# EAGLE design barnabas_noggin_V4 (EAGLE 9.6.2)
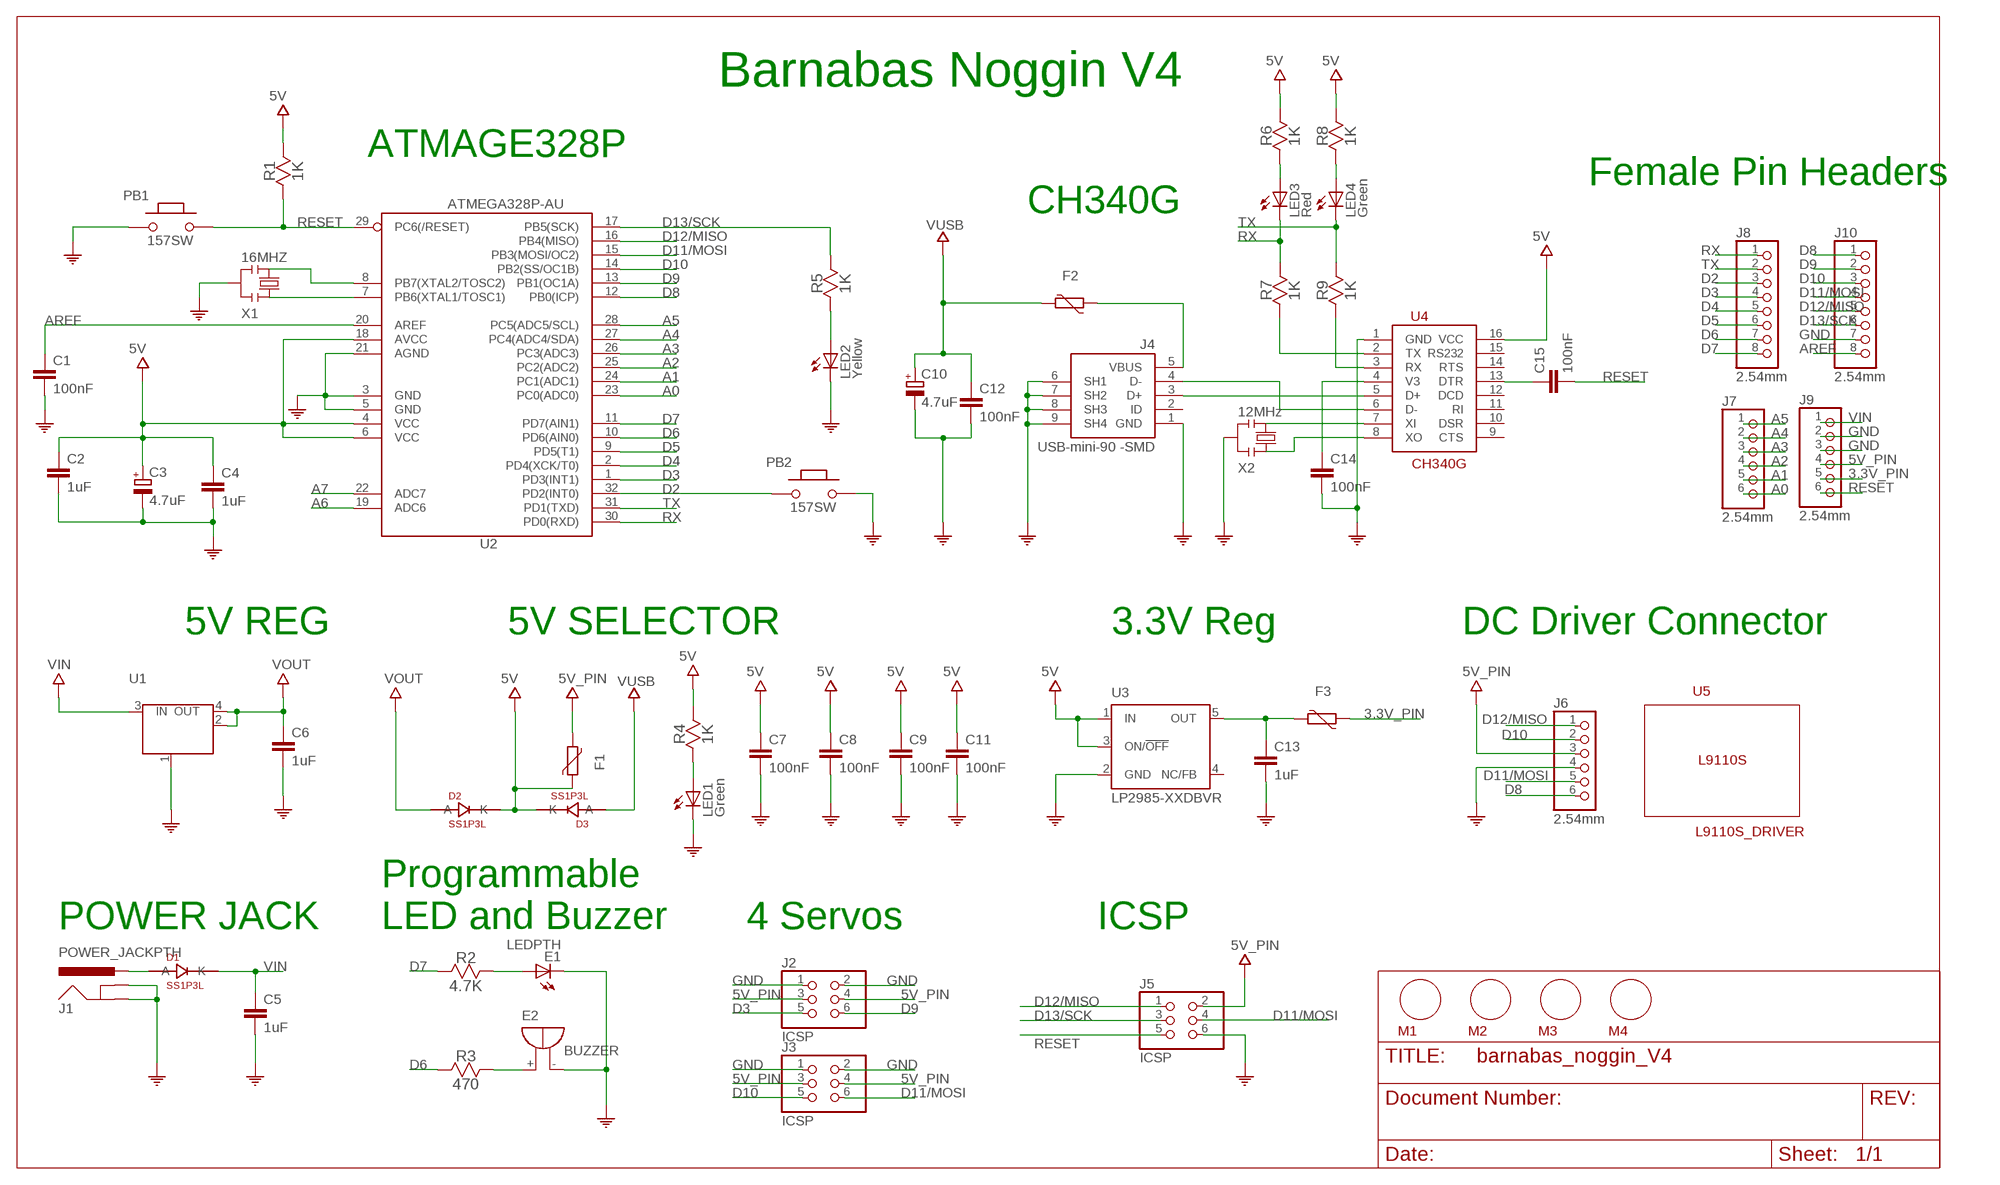
[diagram p0: schematic, sheet 1]

## Parts
C1  100nF  CAPACITOR_100NF_0603  [C0603-ROUND]
C2  1uF  CAPACITOR_1UF_0603  [C0603-ROUND]
C3  4.7uF  CAPACITOR_4.7UF  [TAN-A]
C4  1uF  CAPACITOR_1UF_0603  [C0603-ROUND]
C5  1uF  CAPACITOR_1UF_0603  [C0603-ROUND]
C6  1uF  CAPACITOR_1UF_0603  [C0603-ROUND]
C7  100nF  CAPACITOR_100NF_0603  [C0603-ROUND]
C8  100nF  CAPACITOR_100NF_0603  [C0603-ROUND]
C9  100nF  CAPACITOR_100NF_0603  [C0603-ROUND]
C10  4.7uF  CAPACITOR_4.7UF  [TAN-A]
C11  100nF  CAPACITOR_100NF_0603  [C0603-ROUND]
C12  100nF  CAPACITOR_100NF_0603  [C0603-ROUND]
C13  1uF  CAPACITOR_1UF_0603  [C0603-ROUND]
C14  100nF  CAPACITOR_100NF_0603  [C0603-ROUND]
C15  100nF  CAPACITOR_100NF_0603  [C0603-ROUND]
D1  SS1P3L  SCHOTTKY_DIODE  [DIODI_DO220AAL]
D2  SS1P3L  SCHOTTKY_DIODE  [DIODI_DO220AAL]
D3  SS1P3L  SCHOTTKY_DIODE  [DIODI_DO220AAL]
E1  LEDPTH  [LED5MM]
E2  BUZZER  [BUZZER]
F1  FUSE_6V  [FUSE_0603]
F2  FUSE_6V  [FUSE_0603]
F3  FUSE_6V  [FUSE_0603]
J1  POWER_JACKPTH  [POWER_JACK_PTH]
J2  ICSP  CONNECTOR_2X3  [CONNECTOR_2X3]
J3  ICSP  CONNECTOR_2X3  [CONNECTOR_2X3]
J4  USB-mini-90 -SMD  CONNECTOR_USB_MINI-B  [CONNECTOR_USB_MINI-B]
J5  ICSP  CONNECTOR_2X3  [CONNECTOR_2X3]
J6  2.54mm  PINHD-1X6  [1X06]
J7  2.54mm  PINHD-1X6  [1X06]
J8  2.54mm  PINHD-1X8  [1X08]
J9  2.54mm  PINHD-1X6  [1X06]
J10  2.54mm  PINHD-1X8  [1X08]
LED1  Green  LED_GREEN  [LED_0805]
LED2  Yellow  LED_YELLOW  [LED_0805]
LED3  Red  LED_RED  [LED_0805]
LED4  Green  LED_GREEN  [LED_0805]
M1  MOUNT_HOLE  [MOUNT_HOLE]
M2  MOUNT_HOLE  [MOUNT_HOLE]
M3  MOUNT_HOLE  [MOUNT_HOLE]
M4  MOUNT_HOLE  [MOUNT_HOLE]
PB1  157SW  PUSHBUTTON  [SWITCHES_SMD_157SW]
PB2  157SW  PUSHBUTTON  [SWITCHES_SMD_157SW]
R1  1K  RESISTOR0603  [R0603]
R2  4.7K  RESISTOR  [RESISTOR_PTH]
R3  470  RESISTOR  [RESISTOR_PTH]
R4  1K  RESISTOR0603  [R0603]
R5  1K  RESISTOR0603  [R0603]
R6  1K  RESISTOR0603  [R0603]
R7  1K  RESISTOR0603  [R0603]
R8  1K  RESISTOR0603  [R0603]
R9  1K  RESISTOR0603  [R0603]
U1  LM1117IMPX-5.0  LM1117  [LM1117_SOT223]
U2  ATMEGA328P-AU  ATMEGA328P-32AU  [TQFP32-08]
U3  LP2985-XXDBVR  [SOT23-DBV]
U4  CH340G  [SOIC16]
U5  L9110S_DRIVER  [L9110S_DRIVER]
X1  16MHZ  CRYSTAL_16MHZ  [CRYSTAL]
X2  12MHz  CRYSTAL_12MHZ  [CRYSTAL]

## Nets
3.3V: C13.1 F3.2 U3.5(OUT)
3.3V_PIN: F3.1 J9.5
5V: C2.1 C3.1(+) C4.1 C7.1 C8.1 C9.1 C11.1 D2.P$1(K) D3.P$1(K) F1.1 R1.2 R4.2 R6.2 R8.2 U2.4(VCC) U2.6(VCC) U2.18(AVCC) U3.1(IN) U3.3(ON/!OFF) U4.16(VCC)
5V_PIN: F1.2 J2.3 J2.4 J3.3 J3.4 J5.2 J6.3 J9.4
A0: J7.6 U2.23(PC0(ADC0))
A1: J7.5 U2.24(PC1(ADC1))
A2: J7.4 U2.25(PC2(ADC2))
A3: J7.3 U2.26(PC3(ADC3))
A4: J7.2 U2.27(PC4(ADC4/SDA))
A5: J7.1 U2.28(PC5(ADC5/SCL))
A6: U2.19(ADC6)
A7: U2.22(ADC7)
AREF: C1.1 J10.8 U2.20(AREF)
D2: J8.3 PB2.1 U2.32(PD2(INT0))
D3: J2.5 J8.4 U2.1(PD3(INT1))
D4: J8.5 U2.2(PD4(XCK/T0))
D5: J8.6 U2.9(PD5(T1))
D6: J8.7 R3.1 U2.10(PD6(AIN0))
D7: J8.8 R2.1 U2.11(PD7(AIN1))
D8: J6.6 J10.1 U2.12(PB0(ICP))
D9: J2.6 J10.2 U2.13(PB1(OC1A))
D10: J3.5 J6.2 J10.3 U2.14(PB2(SS/OC1B))
D11/MOSI: J3.6 J5.4 J6.5 J10.4 U2.15(PB3(MOSI/OC2))
D12/MISO: J5.1 J6.1 J10.5 U2.16(PB4(MISO))
D13/SCK: J5.3 J10.6 R5.2 U2.17(PB5(SCK))
GND: C1.2 C2.2 C3.2(-) C4.2 C5.2 C6.2 C7.2 C8.2 C9.2 C10.2(-) C11.2 C12.2 C13.2 C14.2 E1.K(C) E2.- J1.GND J1.GNDBREAK J2.1 J2.2 J3.1 J3.2 J4.1(GND) J4.6(SH1) J4.7(SH2) J4.8(SH3) J4.9(SH4) J5.6 J6.4 J9.2 J9.3 J10.7 LED1.C LED2.C PB1.1 PB2.2 U1.1(GND/ADJ) U2.3(GND) U2.5(GND) U2.21(AGND) U3.2(GND) U4.1(GND) X1.2 X2.2
N$1: U2.8(PB7(XTAL2/TOSC2)) X1.3
N$2: U2.7(PB6(XTAL1/TOSC1)) X1.1
N$3: LED1.A R4.1
N$4: C15.1 U4.13(DTR)
N$5: U4.7(XI) X2.3
N$6: R7.1 U4.2(TX)
N$7: LED3.A R6.1
N$8: R9.1 U4.3(RX)
N$9: LED4.A R8.1
N$10: LED2.A R5.1
N$11: C14.1 U4.4(V3)
N$12: U4.8(XO) X2.1
N$13: J4.3(D+) U4.5(D+)
N$14: J4.4(D-) U4.6(D-)
N$16: D1.P$2(A) J1.PWR
N$17: F2.1 J4.5(VBUS)
N$18: E1.A R2.2
N$19: E2.+ R3.2
RESET: C15.2 J5.5 J9.6 PB1.2 R1.1 U2.29(PC6(/RESET))
RX: J8.1 LED3.C R7.2 U2.30(PD0(RXD))
TX: J8.2 LED4.C R9.2 U2.31(PD1(TXD))
VIN: C5.1 D1.P$1(K) J9.1 U1.3(IN)
VOUT: C6.1 D2.P$2(A) U1.2(OUT) U1.4(OUT)
VUSB: C10.1(+) C12.1 D3.P$2(A) F2.2
Unconnected: J4.2(ID) U3.4(NC/FB) U4.9(CTS) U4.10(DSR) U4.11(RI) U4.12(DCD) U4.14(RTS) U4.15(RS232)

## Notes on the sheet
- Barnabas Noggin V4
- ATMAGE328P
- Female Pin Headers
- CH340G
- 5V REG | 5V SELECTOR | 3.3V Reg | DC Driver Connector
- POWER JACK
- Programmable 
  LED and Buzzer
- 4 Servos | ICSP

## Library data of the parts
C1 C7-C9 C11 C12 C14 C15 = barnabas_noggin_V4:CAPACITOR_100NF_0603: CAP CER 0.1UF 50V Y5V 0603; PARTNO: CC0603ZRY5V9BB104
C2 C4-C6 C13 = barnabas_noggin_V4:CAPACITOR_1UF_0603: 1uF 0603; PARTNO: CC0603KRX5R8BB105
C3 C10 = barnabas_noggin_V4:CAPACITOR_4.7UF: CAP CER 4.7UF 16V X5R 1206; PARTNO: CL31A475KOHNNNE
D1-D3 = barnabas_noggin_V4:SCHOTTKY_DIODE: 1A 30V Schottky Barrier Rectifiers -SS1P3L-M3/84A; PARTNO: SS1P3L-M3/84A
E1 = barnabas_noggin_V4:LEDPTH
E2 = barnabas_noggin_V4:BUZZER: BUZZER Source: Buerklin; OC_FARNELL: unknown; OC_NEWARK: unknown
F1-F3 = barnabas_noggin_V4:FUSE_6V: SMD PTC; PARTNO: MF-FSMF050X-2
J1 = barnabas_noggin_V4:POWER_JACK: Power Jack This is the standard 5.5mm barrel jack for power. The PTH is the most common, proven, reliable, footprint. All others are experimental. The Slot footprint only works if the mill layer is transmitted to the PCB fab house so be warned. Spark Fun Electronics SKU : PRT-00119. Mating wall wart : TOL-00298 (and others); PARTNO: EJ508A
J2 J3 J5 = barnabas_noggin_V4:CONNECTOR_2X3: 3x2 M V h 8,5 mm p2,54; PARTNO: M20-9980346
J4 = barnabas_noggin_V4:CONNECTOR_USB_MINI-B: Usb-Mini F 90 Smd; PARTNO: UJ2-MBH-1-SMT-TR
J6 J7 J9 = barnabas_noggin_V4:PINHD-1X6: PIN HEADER; PARTNO: M20-7820646
J8 J10 = barnabas_noggin_V4:PINHD-1X8: PIN HEADER; PARTNO: PPTC081LFBN-RC
LED1 LED4 = barnabas_noggin_V4:LED_GREEN: LED GREEN - SMD-0805; PARTNO: LTST-C171GKT
LED2 = barnabas_noggin_V4:LED_YELLOW: LED YELLOW - SMD - 0805; PARTNO: LTST-C171KSKT
LED3 = barnabas_noggin_V4:LED_RED: LED RED - SMD - 0805; PARTNO: LTST-C170KRKT
M1-M4 = barnabas_noggin_V4:MOUNT_HOLE
PB1 PB2 = barnabas_noggin_V4:PUSHBUTTON: Pushbutton 4x3 SMD H2,5mm; PARTNO: PTS820 J15M SMTR LFS
R1 R4-R9 = barnabas_noggin_V4:RESISTOR; PARTNO: RC0603FR-071KL
R2 R3 = barnabas_noggin_V4:RESISTOR
U1 = barnabas_noggin_V4:LM1117: Low-dropout linear regulator 5V -LM1117IMPX-5.0; PARTNO: LM1117IMPX-5.0/NOPB
U2 = barnabas_noggin_V4:ATMEGA328P-32: 8-bit Microcontroller with 32KBytes In-System Programmable Flash ATMEGA328P-AU; PARTNO: ATMEGA328P-AU
U3 = barnabas_noggin_V4:LP2985-XXDBVR: ULTRALOW-POWER 50-mA LOW-DROPOUT LINEAR REGULATORS 50-mA Low-Dropout Regulator Source: http://focus.ti.com/lit/ds/symlink/tps77001.pdf; PARTNO: LP2985-33DBVR
U4 = barnabas_noggin_V4:CH340G
U5 = barnabas_noggin_V4:L9110S_DRIVER
X1 = barnabas_noggin_V4:CRYSTAL_16MHZ: 16Mhz - SMD; PARTNO: CSTNE16M0V530000R0
X2 = barnabas_noggin_V4:CRYSTAL_12MHZ; PARTNO: CSTNE12M0G550000R0

## Board
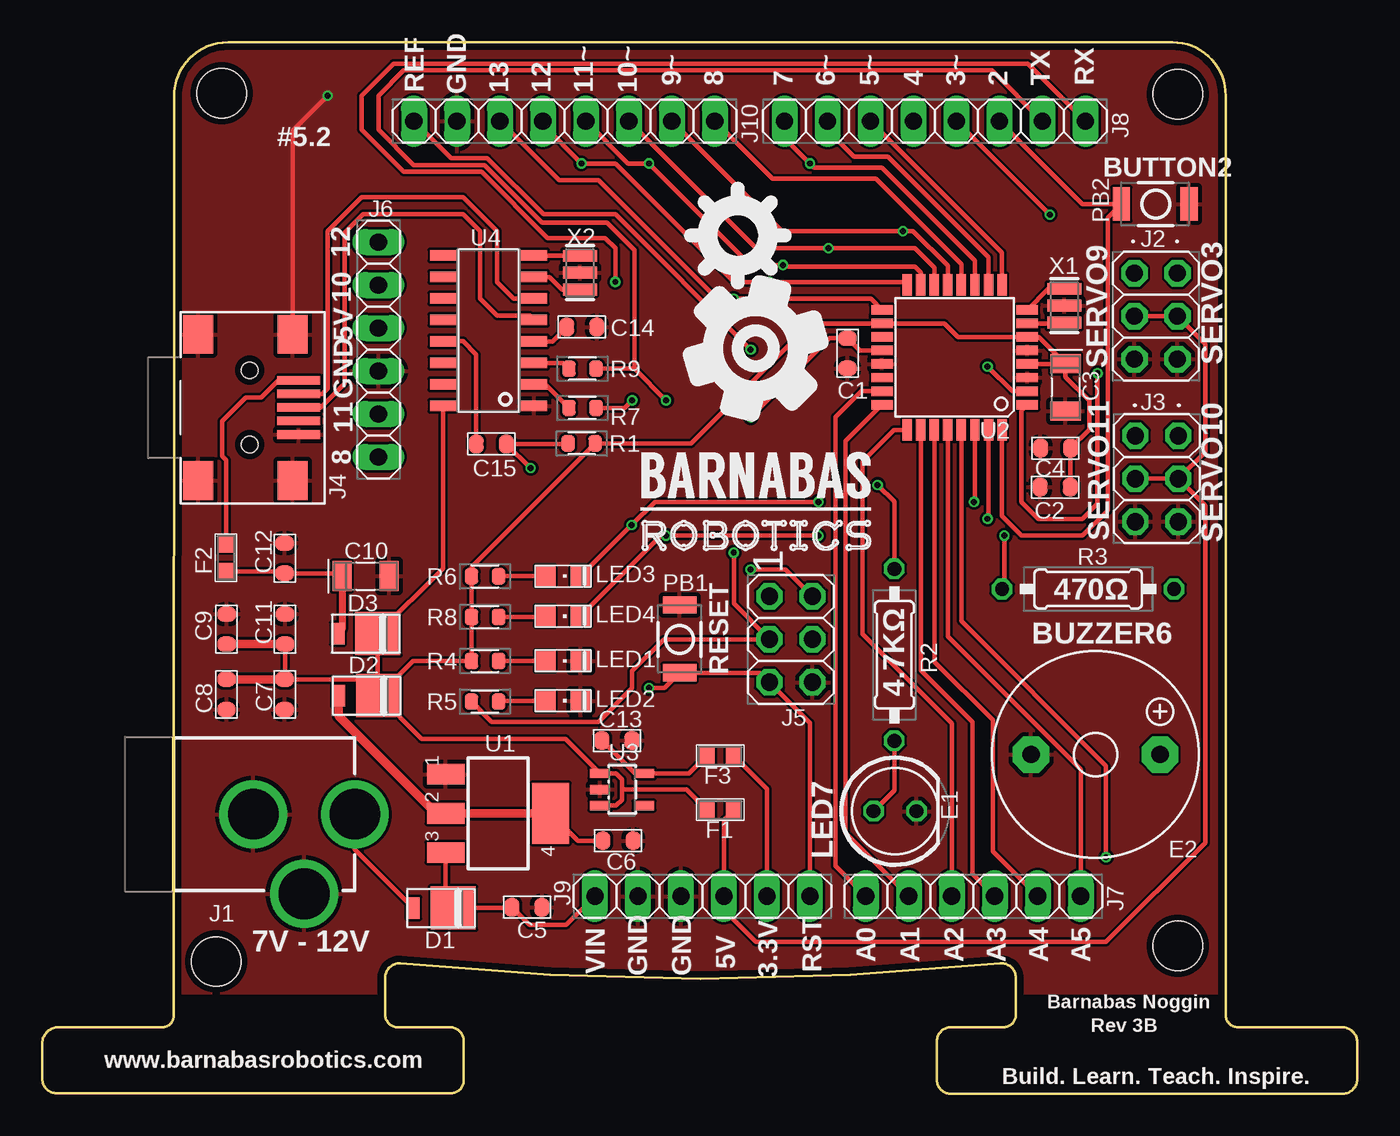
[diagram p1: board, top side]
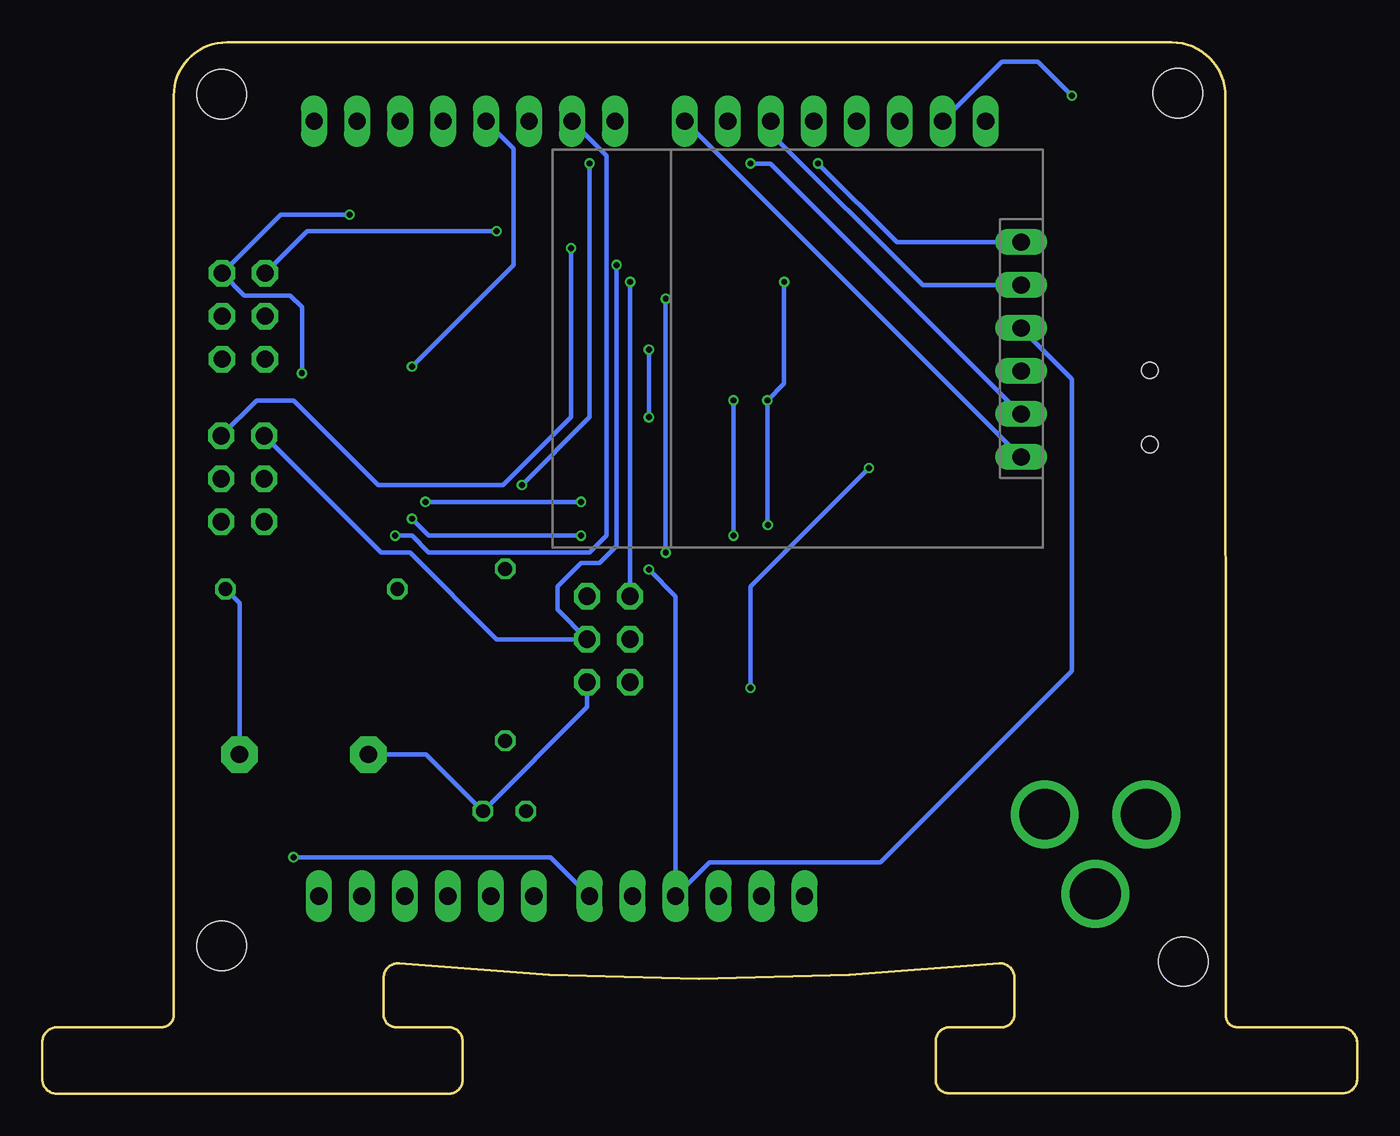
[diagram p2: board, bottom side, seen from below]

Size 77.7 x 62.13 mm. Coordinates in mm from the lower left corner, seen from the top.
Outline: 52.87,3.11 arc-90 53.69,3.93 56.8,3.93 arc90 57.53,4.66 57.53,6.84 arc90 56.63,7.71 arc-12 21.13,7.71 arc90 20.24,6.82 20.24,4.7 arc90 21.02,3.92 24.1,3.92 arc-90 24.89,3.13 24.89,0.76 arc-90 24.17,0.03 0.83,0.03 arc-90 0,0.86 0,2.97 arc-90 0.96,3.93 7.11,3.93 arc90 7.76,4.58 7.78,58.94 arc-90 10.97,62.13 66.79,62.13 arc-90 69.93,58.99 69.93,4.64 arc90 70.64,3.93 76.8,3.93 arc-90 77.7,3.03 77.7,0.84 arc-90 76.86,0 53.65,0 arc-90 52.87,0.78 52.87,3.11
Outline: 52.87,3.11 52.87,3.1
Copper layers (1*16): Top 0.035559375mm / dielectric 1.6mm / Bottom 0.035559375mm
Design rules "oshpark-2layer": minimum track width 6mil, minimum drill 10mil, track to track 6mil, track to pad 6mil, pad to pad 6mil, via to via 6mil, smd to smd 6mil, copper to edge 15mil, drill to drill 6mil, minimum pad ring 5mil, minimum via ring 5mil, stop-mask expansion 2.5mil, vias tented up to drill 0mil, thermal gap 10mil

### Footprints (pad centres in the part's own frame; a part is rotated, then mirrored left to right if it is on the bottom)
C0603-ROUND = smd 0.898 x 1.1: 1 -0.889,0; 2 0.889,0
TAN-A = smd 1.118 x 1.778: 1 0,0; 2 2.794,0
DIODI_DO220AAL = smd 2.667 x 2.54: P$1 -0.7,0 | smd 0.762 x 1.27: P$2 1.65,0
LED5MM = drill 0.813 octagon: A -1.27,0; K 1.27,0
BUZZER = drill 1.016 pad 2.159 octagon: + 3.81,0; - -3.81,0
FUSE_0603 = smd 0.95 x 1: 1 -0.8,0; 2 0.8,0
POWER_JACK_PTH = drill 2.997: GND 0,7.7; GNDBREAK 4.7,10.7; PWR 0,13.7
CONNECTOR_2X3 = drill 1.016 pad 1.55 octagon: 1 -2.54,-1.27; 2 -2.54,1.27; 3 0,-1.27; 4 0,1.27; 5 2.54,-1.27; 6 2.54,1.27
CONNECTOR_USB_MINI-B = smd 0.508 x 2.54: 1 0,0; 2 0.8,0; 3 1.6,0; 4 2.4,0; 5 3.2,0 | smd 2.286 x 1.778: 6 -2.717,5.948; 7 -2.717,0.36; 8 5.918,0.36; 9 5.918,5.948 | hole 0.95: -0.6,2.9; 3.8,2.9
1X06 = drill 1.016 long: 1 -6.35,0; 2 -3.81,0; 3 -1.27,0; 4 1.27,0; 5 3.81,0; 6 6.35,0
1X08 = drill 1.016 long: 1 -8.89,0; 2 -6.35,0; 3 -3.81,0; 4 -1.27,0; 5 1.27,0; 6 3.81,0; 7 6.35,0; 8 8.89,0
LED_0805 = smd 1.2 x 1.2: A 0,-1.05; C 0,1.05
MOUNT_HOLE = hole 2.9: 0,0
SWITCHES_SMD_157SW = smd 1.016 x 1.981: 1 0,0; 2 4,0
R0603 = smd 0.8 x 0.95: 1 -0.8,0; 2 0.8,0
RESISTOR_PTH = drill 0.813 octagon: 1 -5.08,0; 2 5.08,0
LM1117_SOT223 = smd 1.219 x 2.235: 1 -2.311,-3.099; 2 0,-3.099; 3 2.311,-3.099 | smd 3.6 x 2.2: 4 0,3.099
TQFP32-08 = smd 1.27 x 0.559: 1 -4.293,2.8; 2 -4.293,2; 3 -4.293,1.2; 4 -4.293,0.4; 5 -4.293,-0.4; 6 -4.293,-1.2; 7 -4.293,-2; 8 -4.293,-2.8; 17 4.293,-2.8; 18 4.293,-2; 19 4.293,-1.2; 20 4.293,-0.4; 21 4.293,0.4; 22 4.293,1.2; 23 4.293,2; 24 4.293,2.8 | smd 0.559 x 1.27: 9 -2.8,-4.293; 10 -2,-4.293; 11 -1.2,-4.293; 12 -0.4,-4.293; 13 0.4,-4.293; 14 1.2,-4.293; 15 2,-4.293; 16 2.8,-4.293; 25 2.8,4.293; 26 2,4.293; 27 1.2,4.293; 28 0.4,4.293; 29 -0.4,4.293; 30 -1.2,4.293; 31 -2,4.293; 32 -2.8,4.293
SOT23-DBV = smd 0.55 x 1.2: 1 -0.95,-1.3; 2 0,-1.3; 3 0.95,-1.3; 4 0.95,1.3; 5 -0.95,1.3
SOIC16 = smd 0.635 x 1.524: 1 -4.445,-2.695; 2 -3.175,-2.695; 3 -1.905,-2.695; 4 -0.635,-2.695; 5 0.635,-2.695; 6 1.905,-2.695; 7 3.175,-2.695; 8 4.445,-2.695; 9 4.445,2.695; 10 3.175,2.695; 11 1.905,2.695; 12 0.635,2.695; 13 -0.635,2.695; 14 -1.905,2.695; 15 -3.175,2.695; 16 -4.445,2.695
CRYSTAL = smd 0.7 x 2: 1 -1,0; 2 0,0; 3 1,0

### Placement (x,y rotation side)
C1  47.59,43.75 270 top
C2  59.85,35.84 180 top
C3  60.47,43.14 270 top
C4  59.87,38.14 180 top
C5  28.64,11.02 0 top
C6  34.02,14.95 0 top
C7  14.33,23.59 270 top
C8  10.88,23.59 270 top
C9  10.89,27.45 90 top
C10  17.71,30.58 0 top
C11  14.34,27.45 90 top
C12  14.33,31.64 90 top
C13  33.96,20.87 0 top
C14  31.88,45.3 0 top
C15  26.53,38.4 0 top
D1  23.57,10.97 180 top
D2  19.17,23.52 180 top
D3  19.12,27.18 180 top
E1  50.39,16.69 0 top
E2  62.24,20.04 0 top
F1  40.06,16.77 0 top
F2  10.86,31.67 270 top
F3  40.06,19.97 180 top
J1  4.77,16.51 270 top
J2  65.81,45.94 90 top
J3  65.86,36.34 90 top
J4  15.15,38.95 90 top
J5  44.24,26.85 270 top
J6  19.86,43.97 270 top
J7  55.01,11.67 180 top
J8  52.75,57.47 180 top
J9  39.01,11.67 0 top
J10  30.85,57.47 180 top
LED1  30.77,25.57 270 top
LED2  30.77,23.22 270 top
LED3  30.77,30.59 270 top
LED4  30.77,28.22 270 top
M1  10.6,59.12 0 top
M2  67.1,59.06 0 top
M3  10.28,7.81 0 top
M4  67.1,8.73 0 top
PB1  37.66,28.87 270 top
PB2  63.76,52.57 0 top
R1  31.87,38.43 0 top
R2  50.35,25.93 270 top
R3  61.8,29.82 0 top
R4  26.16,25.57 180 top
R5  26.16,23.17 180 top
R6  26.16,30.57 180 top
R7  31.92,40.52 0 top
R8  26.16,28.17 180 top
R9  31.92,42.84 0 top
U1  26.94,16.56 270 top
U2  53.91,43.52 180 top
U3  34.26,17.97 270 top
U4  26.37,45.09 90 top
U5  18.56,32.27 90 bottom
U$14  [BARNABAS_LOGO]  35.26,31.97 0 top
X1  60.39,46.56 90 top
X2  31.77,48.51 270 top

### Tracks (layer width: path | path; a pad name or v marks a point on that pad's centre or on a via)
3.3V
  Top 0.254: C13.1 35.02,18.92 U3.5 38.21,18.92 F3.2
3.3V_PIN
  Top 0.254: F3.1 42.82,18.01 J9.5
5V
  Top 0.254: 20.09,23.74 21.92,25.57 R4.2 R8.2 R6.2 25.36,31.12 R1.2 38.32,38.43 45.41,45.52 U2.18 53.31,45.52 54.12,44.71 U2.6 58.89,44.71 C3.1 | 20.09,23.74 D2.P$1 | 20.09,23.74 19.82,24.01 D3.P$1 23.68,31.04 U4.16 | D2.P$1 18.91,24.48 C7.1 C11.1 | D2.P$1 22.42,20.97 30.91,20.97 U3.1 33.91,18.92 34.26,18.57 34.26,17.97 | U2.4 60.45,43.12 C3.1 | C3.1 60.47,42.36 61.86,40.97 61.86,39.24 C4.1 60.76,35.86 C2.1 | U3.3 33.91,17.02 34.26,17.37 34.26,17.97 | F1.1 38.06,17.97 34.26,17.97
  Top 0.508: C11.1 C9.1 | C7.1 C8.1
5V_PIN  (via drill 0.35)
  Top 0.254: J2.4 J2.3 68.71,44.31 68.71,37.92 J3.3 | J3.3 J3.4 | J5.2 43.93,30.97 v41.86,30.97 | J3.3 68.71,34.76 68.71,14.82 62.86,8.97 42.18,8.97 40.28,10.87 J9.4 40.28,16.19 F1.2
  Bottom 0.254: v41.86,30.97 40.28,29.39 J9.4 38.28,13.67 28.16,13.67 16.86,24.97 16.86,42.24 J6.3
A0
  Top 0.254: J7.6 46.86,13.47 46.86,39.97 48.41,41.52 U2.23
A1
  Top 0.254: J7.5 47.46,15.41 47.46,38.56 U2.24
A2
  Top 0.254: 48.46,37.37 48.46,27.17 53.76,21.87 53.76,11.69 J7.4 | 48.46,37.37 | 48.46,37.37 49.96,38.87 50.32,39.22 U2.25
A3
  Top 0.254: J7.3 54.96,12.99 54.96,21.97 51.91,25.02 U2.26
A4
  Top 0.254: J7.2 56.16,14.33 56.16,22.07 52.71,25.52 52.71,35.97 U2.27
A5
  Top 0.254: J7.1 61.36,19.17 53.51,27.02 U2.28
AREF  (via drill 0.35)
  Top 0.254: J10.8 24.15,55.28 26.3,55.28 29.61,51.97 33.86,51.97 v41.86,43.97 | U2.20 48.31,43.91 C1.1 46.53,44.64 v41.86,39.97
  Bottom 0.254: v41.86,39.97 v41.86,43.97
D2
  Top 0.254: U2.32 56.71,34.12 57.86,32.97 61.46,32.97 62.96,34.47 62.96,51.77 PB2.1 61.46,52.57 J8.3
D3  (via drill 0.35)
  Top 0.254: J8.4 v59.54,51.95 | U2.1 57.86,40.37 57.86,34.97 58.86,33.97 61.46,33.97 62.36,34.87 v62.36,42.57
  Bottom 0.254: v59.54,51.95 59.56,51.93 63.63,51.93 J2.5 65.77,47.17 63.06,47.17 62.36,46.47 v62.36,42.57
D4  (via drill 0.35)
  Top 0.254: U2.2 57.31,41.52 v55.86,42.97
  Bottom 0.254: v55.86,42.97 49.86,48.97 49.86,55.85 J8.5
D5
  Top 0.254: U2.9 56.71,49.7 J8.6
D6  (via drill 0.35)
  Top 0.254: U2.10 55.91,49.42 49.96,55.37 47.96,55.37 46.4,56.93 J8.7 | R3.1 56.86,29.96 v56.86,32.97
  Bottom 0.254: J8.7 44.36,55.43 44.36,32.97 45.36,31.97 54.86,31.97 55.86,32.97 v56.86,32.97
D7  (via drill 0.35)
  Top 0.254: U2.11 55.11,49.22 49.61,54.72 45.61,54.72 v45.36,54.97 43.86,56.47 J8.8 | R2.1 50.35,34.98 v49.36,35.97
  Bottom 0.254: v49.36,35.97 45.36,39.97 v45.36,54.97
D8
  Top 0.254: U2.12 54.31,49.02 49.26,54.07 43.14,54.07 J10.1
  Bottom 0.254: J6.6 39.74,57.5 J10.1
D9  (via drill 0.35)
  Top 0.254: J10.2 43.7,50.97 v50.86,50.97 51.46,50.97 53.51,48.92 U2.13
  Bottom 0.254: J2.6 62.05,50.97 v50.86,50.97
D10  (via drill 0.35)
  Top 0.254: J10.3 42.16,49.97 v46.46,49.97 51.56,49.97 52.71,48.82 U2.14
  Bottom 0.254: J6.2 25.67,47.78 34.66,56.77 J10.3 | J3.5 65.04,40.97 62.86,40.97 57.86,35.97 50.46,35.97 46.46,39.97 v46.46,49.97
D11/MOSI  (via drill 0.35)
  Top 0.254: J10.4 34.62,54.97 v35.86,54.97 41.86,48.97 v43.76,48.97 43.86,48.87 51.56,48.87 51.91,48.52 U2.15
  Bottom 0.254: J3.6 57.68,31.97 55.98,31.97 50.86,26.85 J5.4 47.26,28.6 47.26,29.97 45.86,31.37 44.76,31.37 43.76,32.37 v43.76,48.97 | J6.5 34.67,54.97 v35.86,54.97
D12/MISO  (via drill 0.35)
  Top 0.254: J10.5 29.58,57.25 v31.86,54.97 33.86,54.97 40.86,47.97 v42.96,47.97 49.86,47.97 50.16,47.97 50.95,47.97 U2.16
  Bottom 0.254: J5.1 v42.97,47.96 v42.96,47.97 | v31.86,54.97 27.21,50.32 J6.1
D13/SCK  (via drill 0.35)
  Top 0.254: v40.86,31.97 40.86,28.96 J5.3 36.74,26.85 34.86,24.97 34.86,23.97 32.86,21.97 26.56,21.97 R5.2 | J10.6 30.54,53.97 32.86,53.97 39.86,46.97 v40.86,46.97 48.96,46.97 U2.17
  Bottom 0.254: v40.86,31.97 v40.86,46.97
GND  (via drill 0.35)
  Top 0.254: v16.86,58.97 14.79,56.9 J4.8
  Bottom 0.254: v16.86,58.97 18.86,60.97 21,60.97 J10.7 | J5.6 45.51,22.84 E1.K 55.01,20.04 E2.-
  pour Top: 8.06,61.97 8.06,5.97 69.46,5.97 69.46,61.97
N$1
  Top 0.254: U2.8 59.45,47.56 X1.3
N$2
  Top 0.254: U2.7 60.34,45.52 X1.1
N$3
  Top 0.254: R4.1 LED1.A
N$4
  Top 0.254: C15.1 25.64,43.69 24.86,44.47 23.69,44.47 U4.13
N$5
  Top 0.254: U4.7 29.96,48.27 30.72,47.51 X2.3
N$6
  Top 0.254: U4.2 29.72,41.91 R7.1
N$7
  Top 0.254: R6.1 26.98,30.59 LED3.A
N$8
  Top 0.254: U4.3 30.77,43.19 R9.1
N$9
  Top 0.254: R8.1 29.67,28.17 LED4.A
N$10
  Top 0.254: LED2.A 27.01,23.22 R5.1
N$11
  Top 0.254: C14.1 30.15,44.45 U4.4
N$12
  Top 0.254: U4.8 29.09,49.51 X2.1
N$13
  Top 0.254: J4.3 16.44,40.55 17.86,41.97 17.86,50.87 18.96,51.97 24.86,51.97 25.86,50.97 25.86,46.97 26.86,45.97 28.82,45.97 U4.5
N$14
  Top 0.254: J4.4 16.54,41.35 16.86,41.67 16.86,50.97 18.86,52.97 24.86,52.97 26.86,50.97 26.86,47.97 27.84,46.99 U4.6
N$16
  Top 0.254: J1.PWR 18.47,14.42 D1.P$2
N$17
  Top 0.254: J4.5 13.94,42.15 12.92,41.13 12.02,41.13 10.63,39.74 10.63,37.68 10.86,37.45 F2.1
N$18
  Top 0.254: E1.A 50.35,17.92 R2.2
N$19
  Bottom 0.254: R3.2 66.05,28.99 E2.+
RESET  (via drill 0.35)
  Top 0.254: R1.1 31.04,38.4 C15.2 v28.85,36.97 v28.86,36.97 | v35.86,23.97 36.77,23.97 PB1.2 42.41,24.87 J5.5 45.36,21.92 J9.6 | v62.86,13.97 62.86,19.37 54.31,27.92 U2.29
  Bottom 0.254: v28.86,36.97 35.86,29.97 v35.86,23.97 | v62.86,13.97 47.66,13.97 J9.6
RX  (via drill 0.35)
  Top 0.254: LED3.C v34.83,33.6 36.2,34.97 v45.86,34.97 | R7.2 34.41,40.52 v34.86,40.97 | v33.86,47.97 33.86,49.97 33.26,50.57 29.86,50.57 25.96,54.47 21.36,54.47 18.86,56.97 18.86,58.97 20.77,60.88 58.23,60.88 J8.1 | U2.30 55.11,35.02 v55.06,34.97
  Bottom 0.254: v34.83,33.6 34.86,33.63 v34.86,40.97 33.86,41.97 v33.86,47.97 | v55.06,34.97 v45.86,34.97
TX  (via drill 0.35)
  Top 0.254: v45.86,32.97 v36.86,32.97 36.57,32.97 LED4.C | R9.2 34.99,42.84 | 34.99,42.84 v36.86,40.97 | 34.99,42.84 34.99,49.84 33.36,51.47 29.54,51.47 26.13,54.88 21.95,54.88 19.86,56.97 19.86,58.97 21.36,60.47 56.1,60.47 J8.2 | v55.86,33.97 55.91,34.02 U2.31
  Bottom 0.254: v36.86,40.97 v36.86,32.97 | v55.86,33.97 54.86,32.97 v45.86,32.97
VIN
  Top 0.254: U1.3 23.84,11.4 D1.P$1 27.7,10.97 C5.1 28.8,9.97 30.96,9.97 J9.1
VOUT
  Top 0.254: U1.4 31.65,14.95 C6.1
  Top 0.508: U1.4 U1.2 23.27,16.56 17.52,22.31 D2.P$2
VUSB
  Top 0.152: C10.1 17.54,30.75
  Top 0.254: F2.2 14.21,30.87 C12.1 16.86,30.75 17.54,30.75
  Top 0.406: C10.1 17.71,27.42 D3.P$2

### Text on the board
tPlace: 9~ | 8 | 7 | 6~ | 5~ | 4 | 3~ | 2 | TX | RX | REF | GND | 13 | 12 | 11~ | 10~ | #5.2 | BUTTON2 | 12 | 10 | 5V | SERVO9 | SERVO3 | GND | 11 | 8 | SERVO11 | SERVO10 | 1 | 470Ω | BUZZER6 | RESET | 4.7KΩ | LED7 | 7V - 12V | A0 | A1 | A2 | A3 | A4 | A5 | VIN | GND | GND | 5V | 3.3V | RST | Barnabas Noggin | Rev 3B | www.barnabasrobotics.com | Build. Learn. Teach. Inspire.